# Altium schematic sheet Digital - BlackChat.SchDoc
size B
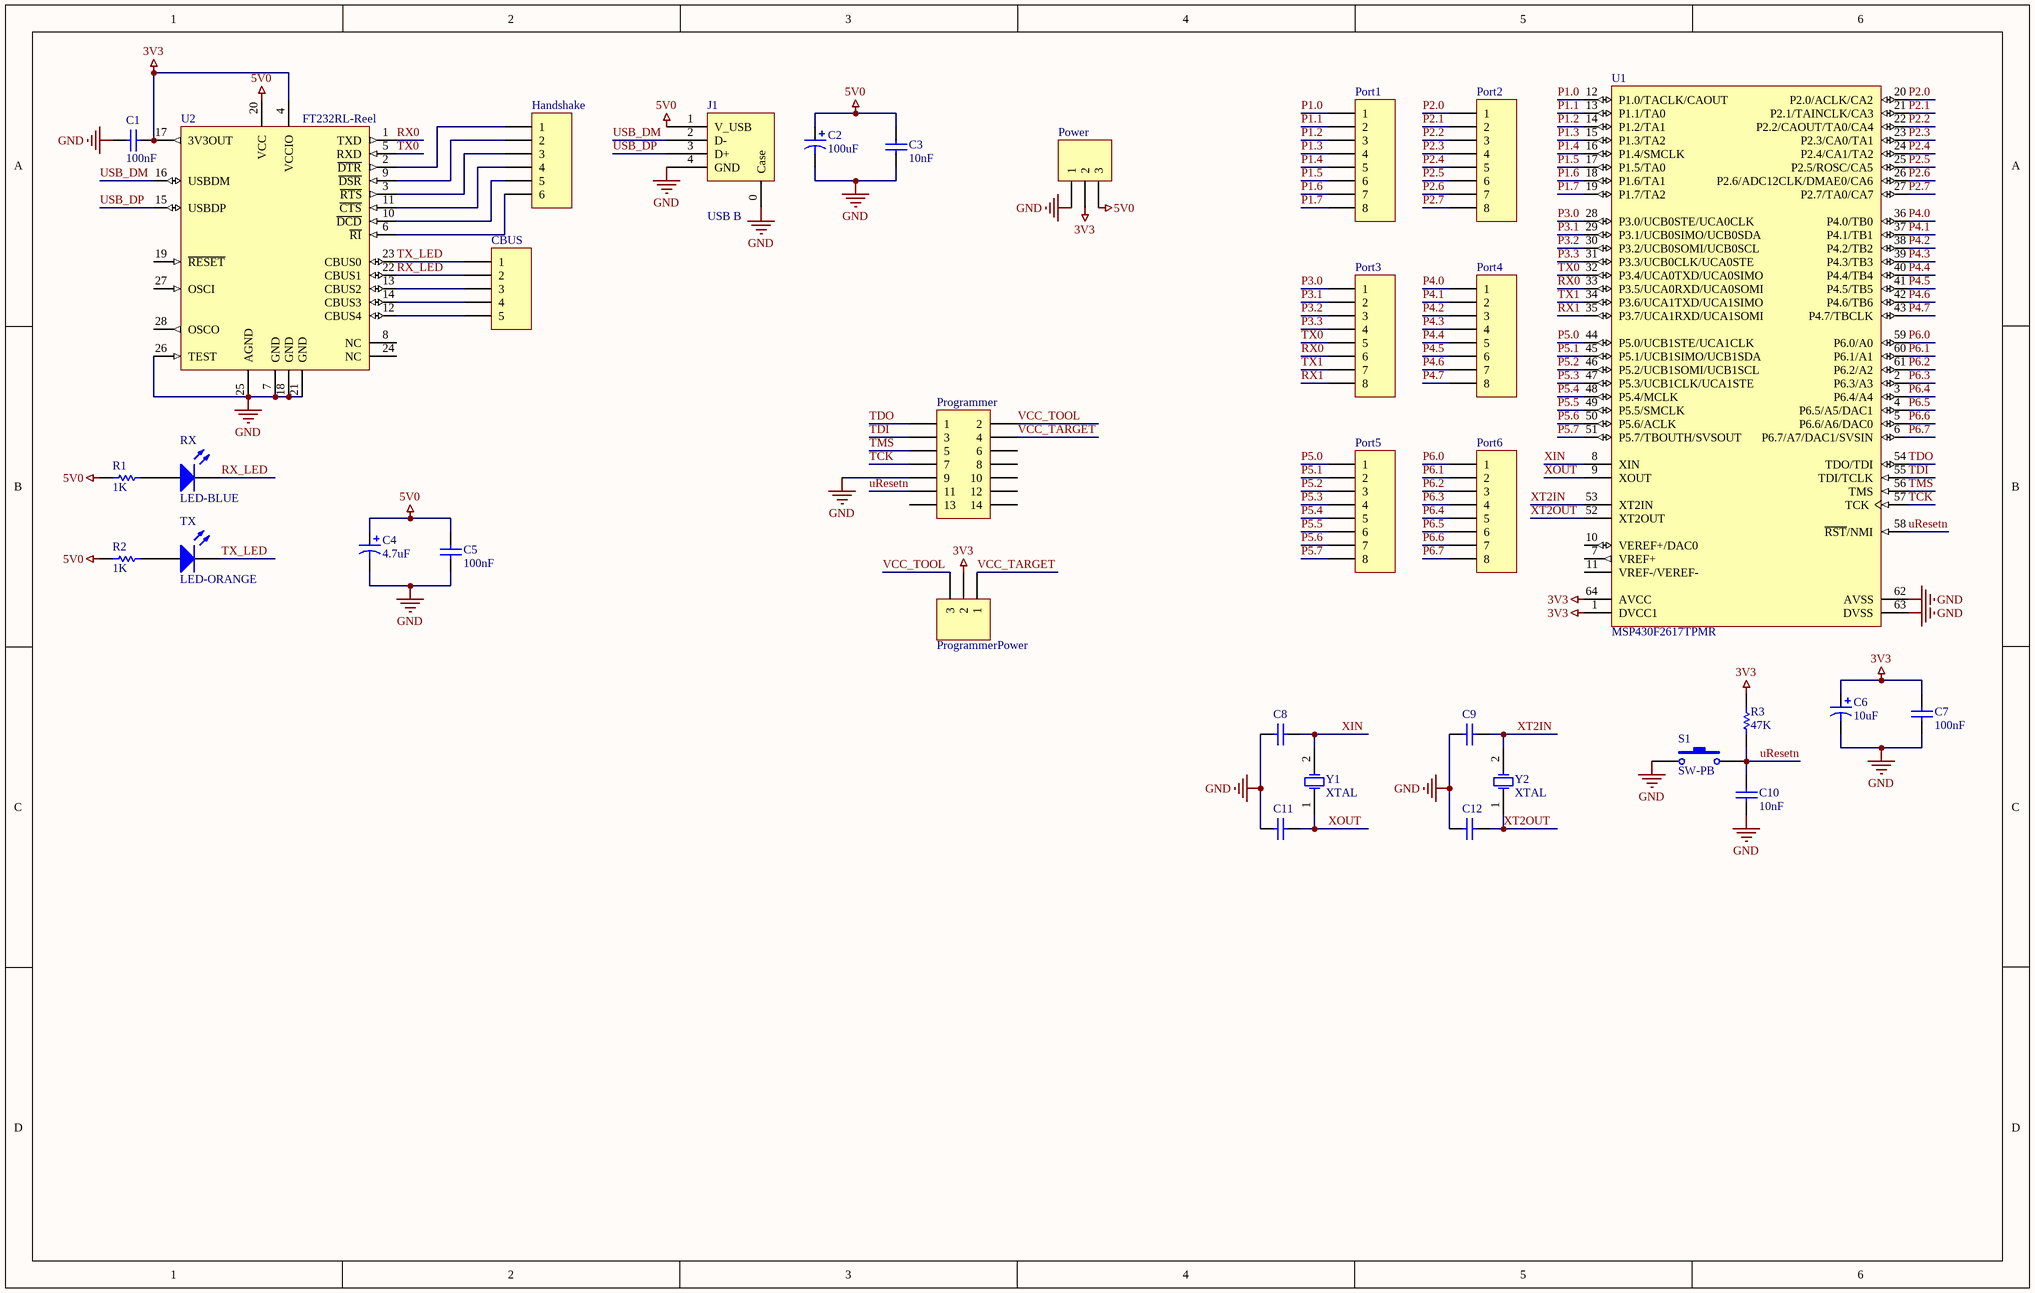
[diagram p0: Digital - BlackChat.SchDoc]

## Parts
C1  value 100nF  [CAP-0805]  (hidden comment: Cap)
C2  value 100uF  [CAP-0805]  (hidden comment: Cap Pol3)
C3  value 10nF  [CAP-0805]  (hidden comment: Cap)
C4  value 4.7uF  [CAP-0805]  (hidden comment: Cap Pol3)
C5  value 100nF  [CAP-0805]  (hidden comment: Cap)
C6  value 10uF  [CAP-0805]  (hidden comment: Cap Pol3)
C7  value 100nF  [CAP-0805]  (hidden comment: Cap)
C8  Cap  [CAP-0805]  (value not drawn)
C9  Cap  [CAP-0805]  (value not drawn)
C10  value 10nF  [CAP-0805]  (hidden comment: Cap)
C11  Cap  [CAP-0805]  (value not drawn)
C12  Cap  [CAP-0805]  (value not drawn)
CBUS  Header 5  [HDR1X5]  (value not drawn)
Handshake  Header 6  [HDR1X6]  (value not drawn)
J1  USB B  [USB-B]
Port1  (no value)  [HDR1X8]
Port2  (no value)  [HDR1X8]
Port3  Header 8  [HDR1X8]  (value not drawn)
Port4  Header 8  [HDR1X8]  (value not drawn)
Port5  Header 8  [HDR1X8]  (value not drawn)
Port6  Header 8  [HDR1X8]  (value not drawn)
Power  Header 3  [HDR1X3]  (value not drawn)
Programmer  Header 7X2  [HDR2X7]  (value not drawn)
ProgrammerPower  Header 3  [HDR1X3]  (value not drawn)
R1  value 1K  [RES-0805]  (hidden comment: Res1)
R2  value 1K  [RES-0805]  (hidden comment: Res1)
R3  value 47K  [RES-0805]  (hidden comment: Res1)
RX  LED-BLUE  [LED-0805]
S1  SW-PB  [SW PB]
TX  LED-ORANGE  [LED-0805]
U1  MSP430F2617TPMR  [TI-PM64_N]
U2  FT232RL-Reel  [SSOP-28_N]
Y1  XTAL  [R38]
Y2  XTAL  [R38]

## Nets
3V3: C1.1 C6.1 C7.2 Power.2 ProgrammerPower.2 R3.2 U1.1(DVCC1) U1.64(AVCC) U2.4(VCCIO) U2.17(3V3OUT)
5V0: C2.1 C3.2 C4.1 C5.2 J1.1(V_USB) Power.3 R1.2 R2.2 U2.20(VCC)
GND: C1.2 C2.2 C3.1 C4.2 C5.1 C6.2 C7.1 C8.2 C9.2 C10.1 C11.2 C12.2 J1.0(Case) J1.4(GND) Power.1 Programmer.9 S1.1 U1.62(AVSS) U1.63(DVSS) U2.7(GND) U2.18(GND) U2.21(GND) U2.25(AGND) U2.26(TEST)
P1.0: Port1.1 U1.12(P1.0/TACLK/CAOUT)
P1.1: Port1.2 U1.13(P1.1/TA0)
P1.2: Port1.3 U1.14(P1.2/TA1)
P1.3: Port1.4 U1.15(P1.3/TA2)
P1.4: Port1.5 U1.16(P1.4/SMCLK)
P1.5: Port1.6 U1.17(P1.5/TA0)
P1.6: Port1.7 U1.18(P1.6/TA1)
P1.7: Port1.8 U1.19(P1.7/TA2)
P2.0: Port2.1 U1.20(P2.0/ACLK/CA2)
P2.1: Port2.2 U1.21(P2.1/TAINCLK/CA3)
P2.2: Port2.3 U1.22(P2.2/CAOUT/TA0/CA4)
P2.3: Port2.4 U1.23(P2.3/CA0/TA1)
P2.4: Port2.5 U1.24(P2.4/CA1/TA2)
P2.5: Port2.6 U1.25(P2.5/ROSC/CA5)
P2.6: Port2.7 U1.26(P2.6/ADC12CLK/DMAE0/CA6)
P2.7: Port2.8 U1.27(P2.7/TA0/CA7)
P3.0: Port3.1 U1.28(P3.0/UCB0STE/UCA0CLK)
P3.1: Port3.2 U1.29(P3.1/UCB0SIMO/UCB0SDA)
P3.2: Port3.3 U1.30(P3.2/UCB0SOMI/UCB0SCL)
P3.3: Port3.4 U1.31(P3.3/UCB0CLK/UCA0STE)
P4.0: Port4.1 U1.36(P4.0/TB0)
P4.1: Port4.2 U1.37(P4.1/TB1)
P4.2: Port4.3 U1.38(P4.2/TB2)
P4.3: Port4.4 U1.39(P4.3/TB3)
P4.4: Port4.5 U1.40(P4.4/TB4)
P4.5: Port4.6 U1.41(P4.5/TB5)
P4.6: Port4.7 U1.42(P4.6/TB6)
P4.7: Port4.8 U1.43(P4.7/TBCLK)
P5.0: Port5.1 U1.44(P5.0/UCB1STE/UCA1CLK)
P5.1: Port5.2 U1.45(P5.1/UCB1SIMO/UCB1SDA)
P5.2: Port5.3 U1.46(P5.2/UCB1SOMI/UCB1SCL)
P5.3: Port5.4 U1.47(P5.3/UCB1CLK/UCA1STE)
P5.4: Port5.5 U1.48(P5.4/MCLK)
P5.5: Port5.6 U1.49(P5.5/SMCLK)
P5.6: Port5.7 U1.50(P5.6/ACLK)
P5.7: Port5.8 U1.51(P5.7/TBOUTH/SVSOUT)
P6.0: Port6.1 U1.59(P6.0/A0)
P6.1: Port6.2 U1.60(P6.1/A1)
P6.2: Port6.3 U1.61(P6.2/A2)
P6.3: Port6.4 U1.2(P6.3/A3)
P6.4: Port6.5 U1.3(P6.4/A4)
P6.5: Port6.6 U1.4(P6.5/A5/DAC1)
P6.6: Port6.7 U1.5(P6.6/A6/DAC0)
P6.7: Port6.8 U1.6(P6.7/A7/DAC1/SVSIN)
RX0: Port3.6 U1.33(P3.5/UCA0RXD/UCA0SOMI) U2.1(TXD)
RX1: Port3.8 U1.35(P3.7/UCA1RXD/UCA1SOMI)
RX_LED: CBUS.2 RX.2(K) U2.22(CBUS1)
TCK: Programmer.7 U1.57(TCK)
TDI: Programmer.3 U1.55(TDI/TCLK)
TDO: Programmer.1 U1.54(TDO/TDI)
TMS: Programmer.5 U1.56(TMS)
TX0: Port3.5 U1.32(P3.4/UCA0TXD/UCA0SIMO) U2.5(RXD)
TX1: Port3.7 U1.34(P3.6/UCA1TXD/UCA1SIMO)
TX_LED: CBUS.1 TX.2(K) U2.23(CBUS0)
uResetn: C10.2 Programmer.11 R3.1 S1.2 U1.58(~{RST}/NMI)
USB_DM: J1.2(D-) U2.16(USBDM)
USB_DP: J1.3(D+) U2.15(USBDP)
VCC_TARGET: Programmer.4 ProgrammerPower.1
VCC_TOOL: Programmer.2 ProgrammerPower.3
XIN: C8.1 U1.8(XIN) Y1.2(OSC2)
XOUT: C11.1 U1.9(XOUT) Y1.1(OSC1)
XT2IN: C9.1 U1.53(XT2IN) Y2.2(OSC2)
XT2OUT: C12.1 U1.52(XT2OUT) Y2.1(OSC1)
NetCBUS_3: CBUS.3 U2.13(CBUS2)
NetCBUS_4: CBUS.4 U2.14(CBUS3)
NetCBUS_5: CBUS.5 U2.12(CBUS4)
NetHandshake_1: Handshake.1 U2.2(~{DTR})
NetHandshake_2: Handshake.2 U2.9(~{DSR})
NetHandshake_3: Handshake.3 U2.3(~{RTS})
NetHandshake_4: Handshake.4 U2.11(~{CTS})
NetHandshake_5: Handshake.5 U2.10(~{DCD})
NetHandshake_6: Handshake.6 U2.6(~{RI})
NetR1_1: R1.1 RX.1(A)
NetR2_1: R2.1 TX.1(A)

Not connected (* = marked no-connect by the designer): Programmer 6 8 10 12 13 14; U1 7(VREF+) 10(VEREF+/DAC0) 11(VREF-/VEREF-); U2 8(NC) 19(~{RESET}) 24(NC) 27(OSCI) 28(OSCO)

## Library data of the parts
C1 C3 C5 C7 C10 = Cap: Capacitor; Published: 8-Jun-2000; LatestRevisionDate: 17-Jul-2002; LatestRevisionNote: Re-released for DXP Platform.; PackageReference: RAD-0.3; Publisher: Altium Limited; PackageDescription: Radial Cap, Thru-Hole; 2 Leads; 0.3 in Pin Spacing
C2 C4 C6 = Cap Pol3: Polarized Capacitor (Surface Mount); Published: 8-Jun-2000; LatestRevisionDate: 29-May-2009; LatestRevisionNote: IPC-7351 Footprint Added.; PackageReference: C0805; Publisher: Altium Limited; PackageDescription: Chip Capacitor
C8 C9 C11 C12 = Cap: Capacitor; Value: 100pF; Published: 8-Jun-2000; LatestRevisionDate: 17-Jul-2002; LatestRevisionNote: Re-released for DXP Platform.; PackageReference: RAD-0.3; Publisher: Altium Limited; PackageDescription: Radial Cap, Thru-Hole; 2 Leads; 0.3 in Pin Spacing
CBUS = Header 5: Header, 5-Pin; LatestRevisionDate: 17-Jul-2002; LatestRevisionNote: Re-released for DXP Platform.; Publisher: Altium Limited
Handshake = Header 6: Header, 6-Pin; LatestRevisionDate: 17-Jul-2002; LatestRevisionNote: Re-released for DXP Platform.; Publisher: Altium Limited
J1 = USB B: On Shore Technology USB-B1HSB6; Supplier 1: Digi-Key; Supplier Part Number 1: ED2983-ND
Port1-Port6 = Header 8: Header, 8-Pin; LatestRevisionDate: 17-Jul-2002; LatestRevisionNote: Re-released for DXP Platform.; Publisher: Altium Limited
Power ProgrammerPower = Header 3: Header, 3-Pin; LatestRevisionDate: 17-Jul-2002; LatestRevisionNote: Re-released for DXP Platform.; Publisher: Altium Limited
Programmer = Header 7X2: Header, 7-Pin, Dual row; LatestRevisionDate: 17-Jul-2002; LatestRevisionNote: Re-released for DXP Platform.; Publisher: Altium Limited
R1-R3 = Res1: Resistor; Published: 8-Jun-2000; LatestRevisionDate: 17-Jul-2002; LatestRevisionNote: Re-released for DXP Platform.; PackageReference: AXIAL-0.3; Publisher: Altium Limited; PackageDescription: Axial Device, Thru-Hole; 2 Leads; 0.3 in Pin Spacing
RX TX = LED-GENERIC: Light Emitting Diode
S1 = SW-PB: DIGIKEY SW400-ND; Published: 24-Mar-1999; LatestRevisionDate: 17-Jul-2002; LatestRevisionNote: Re-released for DXP Platform.; Publisher: Altium Limited
U1 = MSP430F2617TPMR: 16 MHz Mixed Signal Microcontroller with 92 KB Flash, 8192 B SRAM and 48 GPIOs, -40 to 105 degC, 64-pin QFP (PM), Green (RoHS & no Sb/Br); Manufacturer: Texas Instruments; ADC: 12-bit SAR; ADC Channels: 8; Brown Out Reset: Yes; DMA: 3; Flash(KB): 92; Frequency(MHz): 16; GPIO: 48; Multiplier: 16x16; SRAM(B): 8192; SubFamily: 2 Series, Extended Temp; Timers - 16-bit: 2; DatasheetVersion: SLAS541K; PackageVersion: 4040152/C; PackageReference: PM64; PackageDescription: 64-Pin Plastic Quad Flat Pack, Body 10 x 10 mm, Pitch 0.5 mm; Supplier 1: Digi-Key; Supplier Part Number 1: 296-26222-ND; Supplier 2: Farnell; Supplier Part Number 2: 1649453; Supplier 3: Newark; Supplier Part Number 3: 61M7904; Supplier 4: Mouser; Supplier Part Number 4: 595-MSP430F2617TPM; Comparators: Yes; Eco-Plan: Green (RoHS & no Sb/Br); SVS: Yes; Temp Sensor: Yes; USCI_A (UART/LIN/IrDA/SPI): 2; USCI_B (I2C & SPI): 2; Watchdog: Yes; Mounting Technology: Surface Mount; Code_JEDEC: MS-026; PartNumber: MSP430F2617TPMR; ComponentLink1Description: Manufacturer URL; ComponentLink1URL: http://www.ti.com/; ComponentLink2Description: Datasheet; ComponentLink2URL: http://www.ti.com/general/docs/lit/getliterature.tsp?genericPartNumber=MSP430F2617&fileType=pdf; ComponentLink3Description: Package Specification; ComponentLink3URL: http://www.ti.com/lit/ml/mtqf008a/mtqf008a.pdf
U2 = FT232RL-Reel: USB UART Asynchronous Serial Data Transfer Chip, SSOP-28, Tape and Reel; Published: 19-Aug-2010; DatasheetVersion: ver 2.07, Jul-2010; PackageVersion: 2010; PackageReference: SSOP-28; Publisher: Altium Limited; PackageDescription: 28-Pin Small Outline Package 0.65 mm Pitch; ComponentLink1Description: Manufacturer Link; ComponentLink1URL: http://www.ftdichip.com/Products/ICs/FT232R.htm; ComponentLink2Description: Datasheet; ComponentLink2URL: http://www.ftdichip.com/Support/Documents/DataSheets/ICs/DS_FT232R.pdf
Y1 Y2 = XTAL: Crystal Oscillator; Published: 8-Jun-2000; LatestRevisionDate: 17-Jul-2002; LatestRevisionNote: Re-released for DXP Platform.; PackageReference: R38; Publisher: Altium Limited; PackageDescription: Crystal, Thru-Hole; 2 Leads; Body 3.1 x 8.2 mm (Dia.xH)